# Altium schematic sheet con-bot-j1-0.SchDoc: Connector - J1(Bottom) 0
size Letter; CheckedBy: E. Chiu; CompanyName: Signal Laboratories, Inc.; DrawnBy: J. Brinton; Engineer: J. Brinton; Address1: 3479 Edison Way; Address2: Menlo Park CA 94025; Address3: +1 (877) 778-8435; Address4: brintonengineering.com; Revision: 1; SheetNumber: 18; SheetTotal: 40
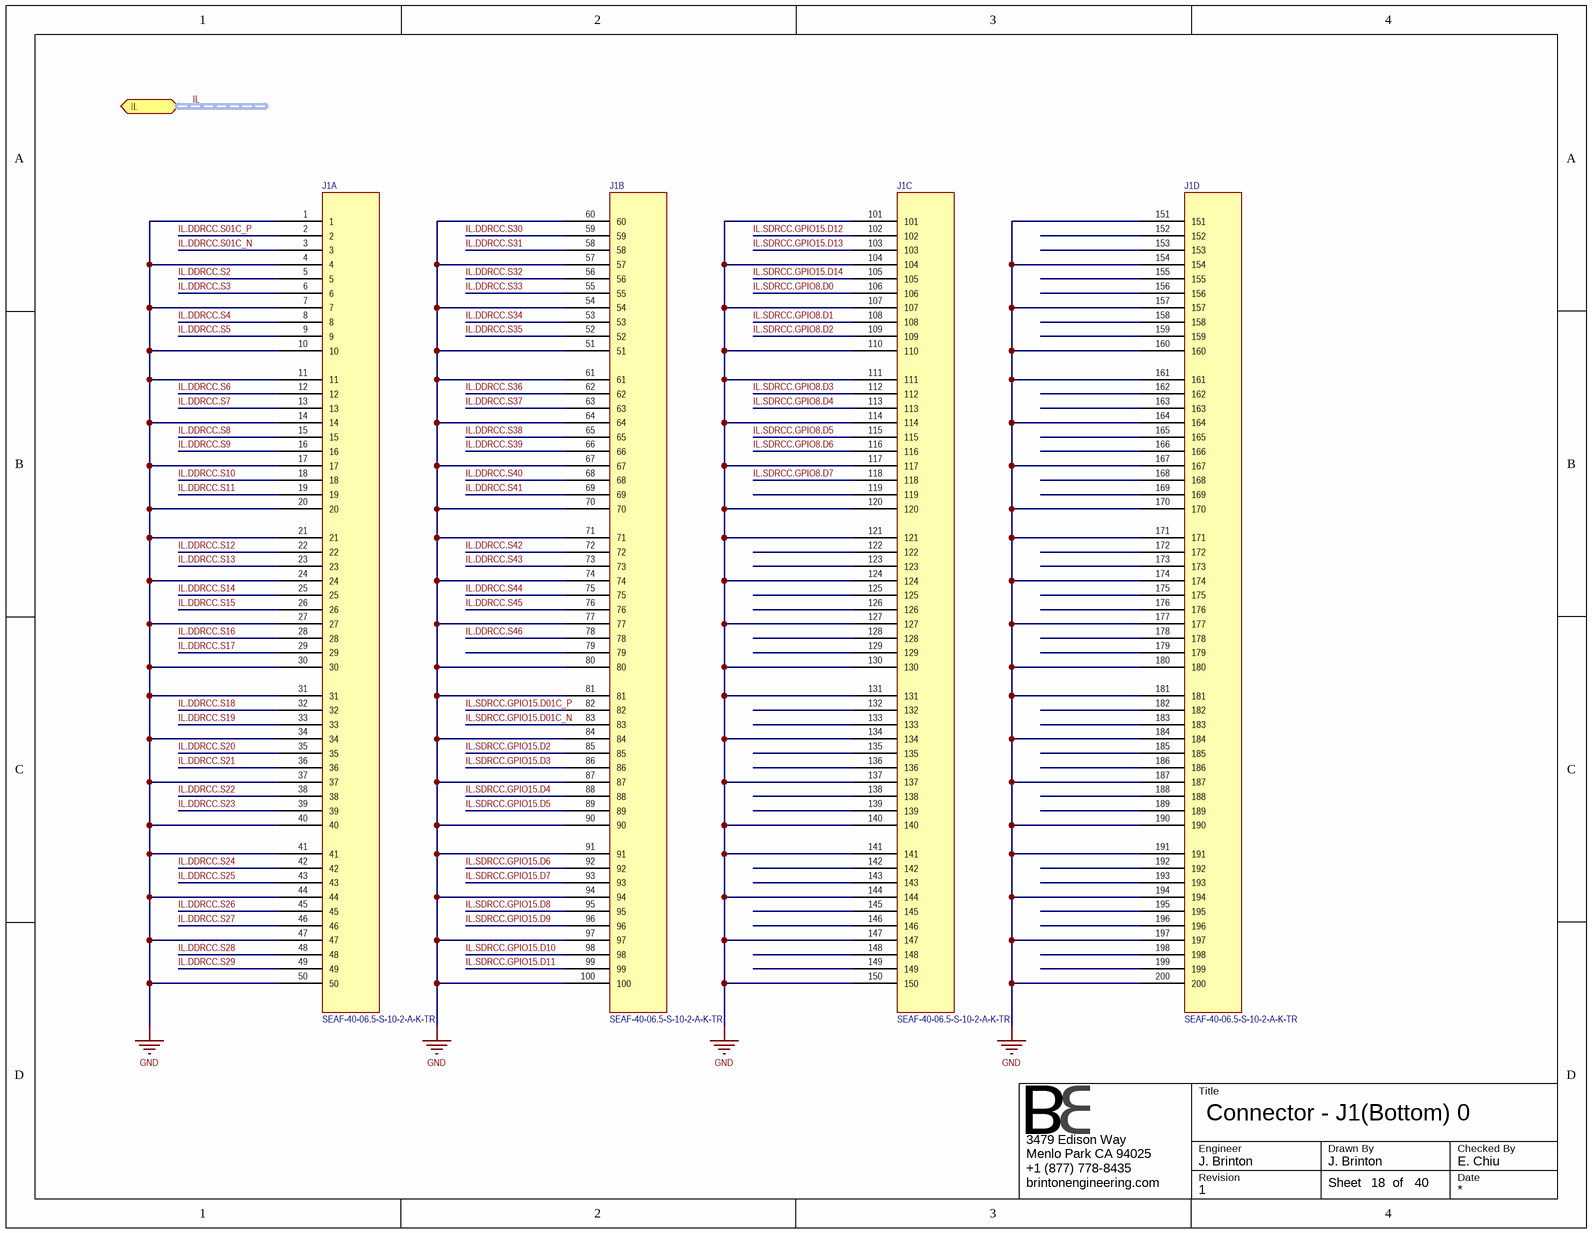
[diagram p0: con-bot-j1-0.SchDoc]

## Parts
J1  SEAF-40-06.5-S-10-2-A-K-TR  [SEAF-40-06.5-S-10-2-A-K-TR]  (parts A,B,C,D of 8)

## Ports
IL (harness IL-1V5)

## Nets
GND: J1.1 J1.4 J1.7 J1.10 J1.11 J1.14 J1.17 J1.20 J1.21 J1.24 J1.27 J1.30 J1.31 J1.34 J1.37 J1.40 J1.41 J1.44 J1.47 J1.50 J1.51 J1.54 J1.57 J1.60 J1.61 J1.64 J1.67 J1.70 J1.71 J1.74 J1.77 J1.80 J1.81 J1.84 J1.87 J1.90 J1.91 J1.94 J1.97 J1.100 J1.101 J1.104 J1.107 J1.110 J1.111 J1.114 J1.117 J1.120 J1.121 J1.124 J1.127 J1.130 J1.131 J1.134 J1.137 J1.140 J1.141 J1.144 J1.147 J1.150 J1.151 J1.154 J1.157 J1.160 J1.161 J1.164 J1.167 J1.170 J1.171 J1.174 J1.177 J1.180 J1.181 J1.184 J1.187 J1.190 J1.191 J1.194 J1.197 J1.200
IL.DDRCC.S01C_N: J1.3
IL.DDRCC.S01C_P: J1.2
IL.DDRCC.S2: J1.5
IL.DDRCC.S3: J1.6
IL.DDRCC.S4: J1.8
IL.DDRCC.S5: J1.9
IL.DDRCC.S6: J1.12
IL.DDRCC.S7: J1.13
IL.DDRCC.S8: J1.15
IL.DDRCC.S9: J1.16
IL.DDRCC.S10: J1.18
IL.DDRCC.S11: J1.19
IL.DDRCC.S12: J1.22
IL.DDRCC.S13: J1.23
IL.DDRCC.S14: J1.25
IL.DDRCC.S15: J1.26
IL.DDRCC.S16: J1.28
IL.DDRCC.S17: J1.29
IL.DDRCC.S18: J1.32
IL.DDRCC.S19: J1.33
IL.DDRCC.S20: J1.35
IL.DDRCC.S21: J1.36
IL.DDRCC.S22: J1.38
IL.DDRCC.S23: J1.39
IL.DDRCC.S24: J1.42
IL.DDRCC.S25: J1.43
IL.DDRCC.S26: J1.45
IL.DDRCC.S27: J1.46
IL.DDRCC.S28: J1.48
IL.DDRCC.S29: J1.49
IL.DDRCC.S30: J1.59
IL.DDRCC.S31: J1.58
IL.DDRCC.S32: J1.56
IL.DDRCC.S33: J1.55
IL.DDRCC.S34: J1.53
IL.DDRCC.S35: J1.52
IL.DDRCC.S36: J1.62
IL.DDRCC.S37: J1.63
IL.DDRCC.S38: J1.65
IL.DDRCC.S39: J1.66
IL.DDRCC.S40: J1.68
IL.DDRCC.S41: J1.69
IL.DDRCC.S42: J1.72
IL.DDRCC.S43: J1.73
IL.DDRCC.S44: J1.75
IL.DDRCC.S45: J1.76
IL.DDRCC.S46: J1.78
IL.SDRCC.GPIO8.D0: J1.106
IL.SDRCC.GPIO8.D1: J1.108
IL.SDRCC.GPIO8.D2: J1.109
IL.SDRCC.GPIO8.D3: J1.112
IL.SDRCC.GPIO8.D4: J1.113
IL.SDRCC.GPIO8.D5: J1.115
IL.SDRCC.GPIO8.D6: J1.116
IL.SDRCC.GPIO8.D7: J1.118
IL.SDRCC.GPIO15.D01C_N: J1.83
IL.SDRCC.GPIO15.D01C_P: J1.82
IL.SDRCC.GPIO15.D2: J1.85
IL.SDRCC.GPIO15.D3: J1.86
IL.SDRCC.GPIO15.D4: J1.88
IL.SDRCC.GPIO15.D5: J1.89
IL.SDRCC.GPIO15.D6: J1.92
IL.SDRCC.GPIO15.D7: J1.93
IL.SDRCC.GPIO15.D8: J1.95
IL.SDRCC.GPIO15.D9: J1.96
IL.SDRCC.GPIO15.D10: J1.98
IL.SDRCC.GPIO15.D11: J1.99
IL.SDRCC.GPIO15.D12: J1.102
IL.SDRCC.GPIO15.D13: J1.103
IL.SDRCC.GPIO15.D14: J1.105

Not connected (* = marked no-connect by the designer): J1 79 119 122 123 125 126 128 129 132 133 135 136 138 139 142 143 145 146 148 149 152 153 155 156 158 159 162 163 165 166 168 169 172 173 175 176 178 179 182 183 185 186 188 189 192 193 195 196 198 199

## Buses and harness runs
harness IL = port IL

## Notes on the sheet
- Title
- Engineer
- Revision
- Drawn By
- Checked By
- Date
- Sheet
- of

## Library data of the parts
J1 = SEAF-40-06.5-S-10-2-A-K-TR: Terminal Array Assembly, Surface Mount, 0.050" Pitch, 400 Pins; Manufacturer: Samtec; Manufacturer P/N: SEAF-40-06.5-S-10-2-A-K-TR